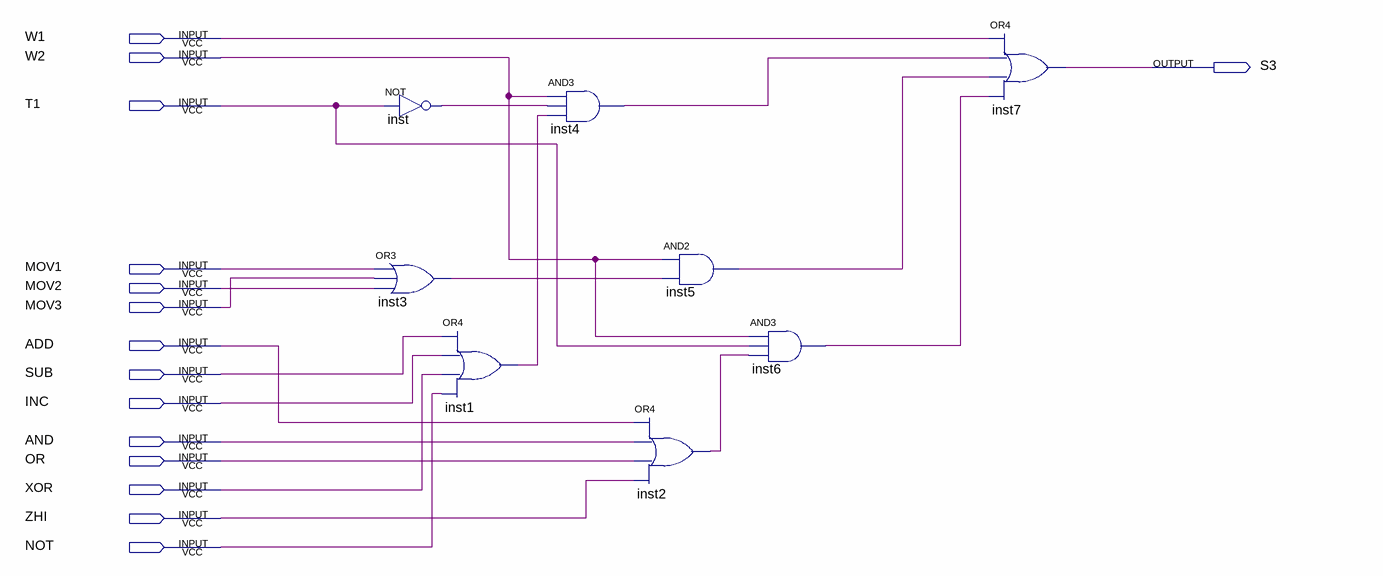
[diagram p0: schematic sheet]
// Quartus schematic S3.bdf as structural Verilog: 8 symbols, 15 pins
module S3 (
  input  W1,
  input  W2,
  input  T1,
  input  MOV1,
  input  MOV2,
  input  MOV3,
  input  ADD,
  input  SUB,
  input  INC,
  input  AND,
  input  OR,
  input  XOR,
  input  ZHI,
  input  NOT,
  output S3
);

  wire inst1_out, inst2_out, inst3_out, inst4_out, inst5_out, inst6_out, inst_out;

  not inst (inst_out, T1);
  or inst3 (inst3_out, MOV1, MOV3, MOV2);
  or inst1 (inst1_out, SUB, INC, XOR, NOT);
  and inst4 (inst4_out, W2, inst_out, inst1_out);
  and inst5 (inst5_out, W2, inst3_out);
  or inst2 (inst2_out, ADD, AND, OR, ZHI);
  and inst6 (inst6_out, W2, T1, inst2_out);
  or inst7 (S3, W1, inst4_out, inst5_out, inst6_out);
endmodule
